# Altium schematic sheet Ldo.+16V5.+15V0.SchDoc
size A4
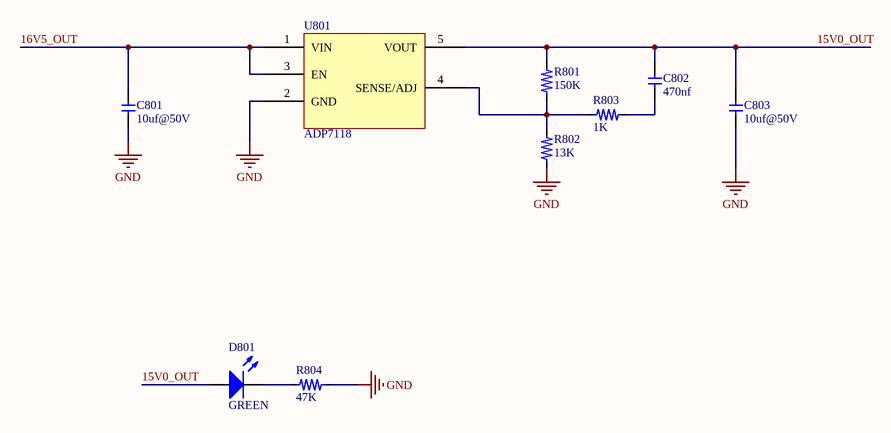
[diagram p0: Ldo.+16V5.+15V0.SchDoc]

## Parts
C801  value 10uf@50V  [C1210]  (hidden comment: Cap)
C802  value 470nf  [C0603]  (hidden comment: Cap)
C803  value 10uf@50V  [C1210]  (hidden comment: Cap)
D801  value GREEN  [LED0603]  (hidden comment: LED)
R801  value 150K  [R0603]  (hidden comment: Res)
R802  value 13K  [R0603]  (hidden comment: Res)
R803  value 1K  [R0603]  (hidden comment: Res)
R804  value 47K  [R0603]  (hidden comment: Res)
U801  ADP7118  [ADP7118-TSOT5]

## Nets
GND: C801.1 C803.1 R802.1 R804.1 U801.2(GND)
15V0_OUT: C802.1 C803.2 D801.1(A) R801.2 U801.5(VOUT)
16V5_OUT: C801.2 U801.1(VIN) U801.3(EN)
NetC802_2: C802.2 R803.1
NetD801_2: D801.2(K) R804.2
NetR801_1: R801.1 R802.2 R803.2 U801.4(SENSE/ADJ)

## Library data of the parts
R801-R804 = Res: 电阻
U801 = ADP7118AUJ: 20 V, 200 mA, Low Noise,CMOS LDO Linear Regulator.